# Altium project LED_280x10.PrjPcb
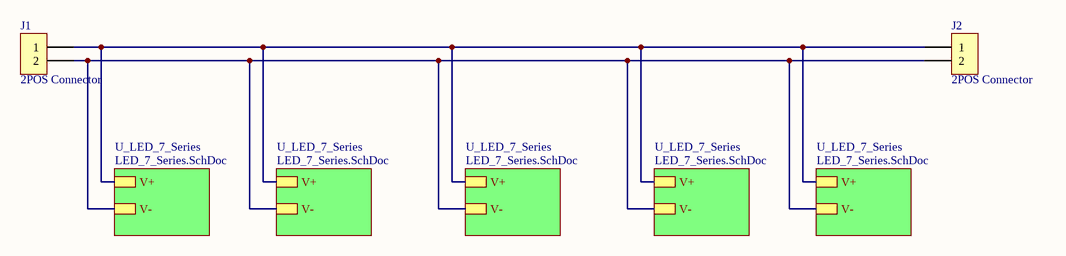
[diagram p0: LED_280x10.SchDoc]
2 sheets, 47 parts. Net scope: hierarchical (ports join the sheet entries above them; power ports are global).
Board file: LED_280X10.PcbDoc
Sheets:
  LED_280x10.SchDoc
    U_LED_7_Series = LED_7_Series.SchDoc
    U_LED_7_Series = LED_7_Series.SchDoc
    U_LED_7_Series = LED_7_Series.SchDoc
    U_LED_7_Series = LED_7_Series.SchDoc
    U_LED_7_Series = LED_7_Series.SchDoc

## Sheet LED_280x10.SchDoc: LED Strip
size A

### Parts
J1  2POS Connector  [2 POS PADs]
J2  2POS Connector  [2 POS PADs]

### Sub-sheets
U_LED_7_Series = LED_7_Series.SchDoc: V+, V-
U_LED_7_Series = LED_7_Series.SchDoc: V+, V-
U_LED_7_Series = LED_7_Series.SchDoc: V+, V-
U_LED_7_Series = LED_7_Series.SchDoc: V+, V-
U_LED_7_Series = LED_7_Series.SchDoc: V+, V-

### Nets
V+: J1.1 J2.1 ; sheet U_LED_7_Series/V+, sheet U_LED_7_Series/V+, sheet U_LED_7_Series/V+, sheet U_LED_7_Series/V+, sheet U_LED_7_Series/V+
V-: J1.2 J2.2 ; sheet U_LED_7_Series/V-, sheet U_LED_7_Series/V-, sheet U_LED_7_Series/V-, sheet U_LED_7_Series/V-, sheet U_LED_7_Series/V-

## Sheet LED_7_Series.SchDoc: LED Series
size A
Used 5 times, as channels U_LED_7_Series, U_LED_7_Series, U_LED_7_Series, U_LED_7_Series, U_LED_7_Series. Parts and nets are listed once, with the designators drawn on the sheet.
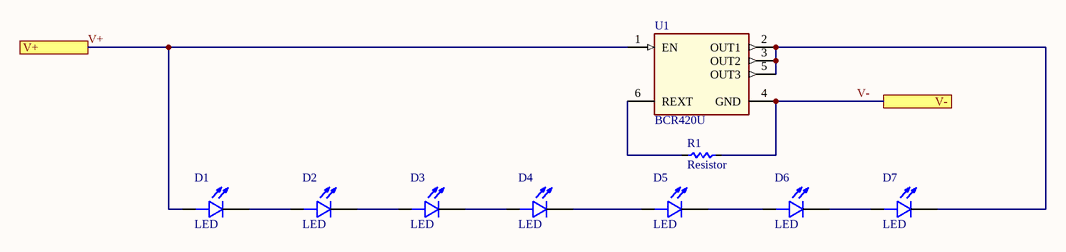
[diagram p1: LED_7_Series.SchDoc]

### Parts
D1  LED  [LED2835N]
D2  LED  [LED2835N]
D3  LED  [LED2835N]
D4  LED  [LED2835N]
D5  LED  [LED2835N]
D6  LED  [LED2835N]
D7  LED  [LED2835N]
R1  Resistor  [RES1206]
U1  BCR420U  [BCR420U]

### Ports
V+, V-

### Nets
V+: D1.A U1.1(EN) ; port V+
V-: R1.1 U1.4(GND) ; port V-
NetD1_C: D1.C D2.A
NetD2_C: D2.C D3.A
NetD3_C: D3.C D4.A
NetD4_C: D4.C D5.A
NetD5_C: D5.C D6.A
NetD6_C: D6.C D7.A
NetD7_C: D7.C U1.2(OUT1) U1.3(OUT2) U1.5(OUT3)
NetR1_2: R1.2 U1.6(REXT)

### Channels
U_LED_7_Series: designators end in _U_LED_7_Series#1; ports V+=V+ V-=V-
U_LED_7_Series: designators end in _U_LED_7_Series#2; ports V+=V+ V-=V-
U_LED_7_Series: designators end in _U_LED_7_Series#3; ports V+=V+ V-=V-
U_LED_7_Series: designators end in _U_LED_7_Series#4; ports V+=V+ V-=V-
U_LED_7_Series: designators end in _U_LED_7_Series#5; ports V+=V+ V-=V-

## Nets that join several sheets
V+: LED_280x10 (J1.1 J2.1), U_LED_7_Series (D1_U_LED_7_Series#1.A U1_U_LED_7_Series#1.1), U_LED_7_Series (D1_U_LED_7_Series#2.A U1_U_LED_7_Series#2.1), U_LED_7_Series (D1_U_LED_7_Series#3.A U1_U_LED_7_Series#3.1), U_LED_7_Series (D1_U_LED_7_Series#4.A U1_U_LED_7_Series#4.1), U_LED_7_Series (D1_U_LED_7_Series#5.A U1_U_LED_7_Series#5.1)
V-: LED_280x10 (J1.2 J2.2), U_LED_7_Series (R1_U_LED_7_Series#1.1 U1_U_LED_7_Series#1.4), U_LED_7_Series (R1_U_LED_7_Series#2.1 U1_U_LED_7_Series#2.4), U_LED_7_Series (R1_U_LED_7_Series#3.1 U1_U_LED_7_Series#3.4), U_LED_7_Series (R1_U_LED_7_Series#4.1 U1_U_LED_7_Series#4.4), U_LED_7_Series (R1_U_LED_7_Series#5.1 U1_U_LED_7_Series#5.4)